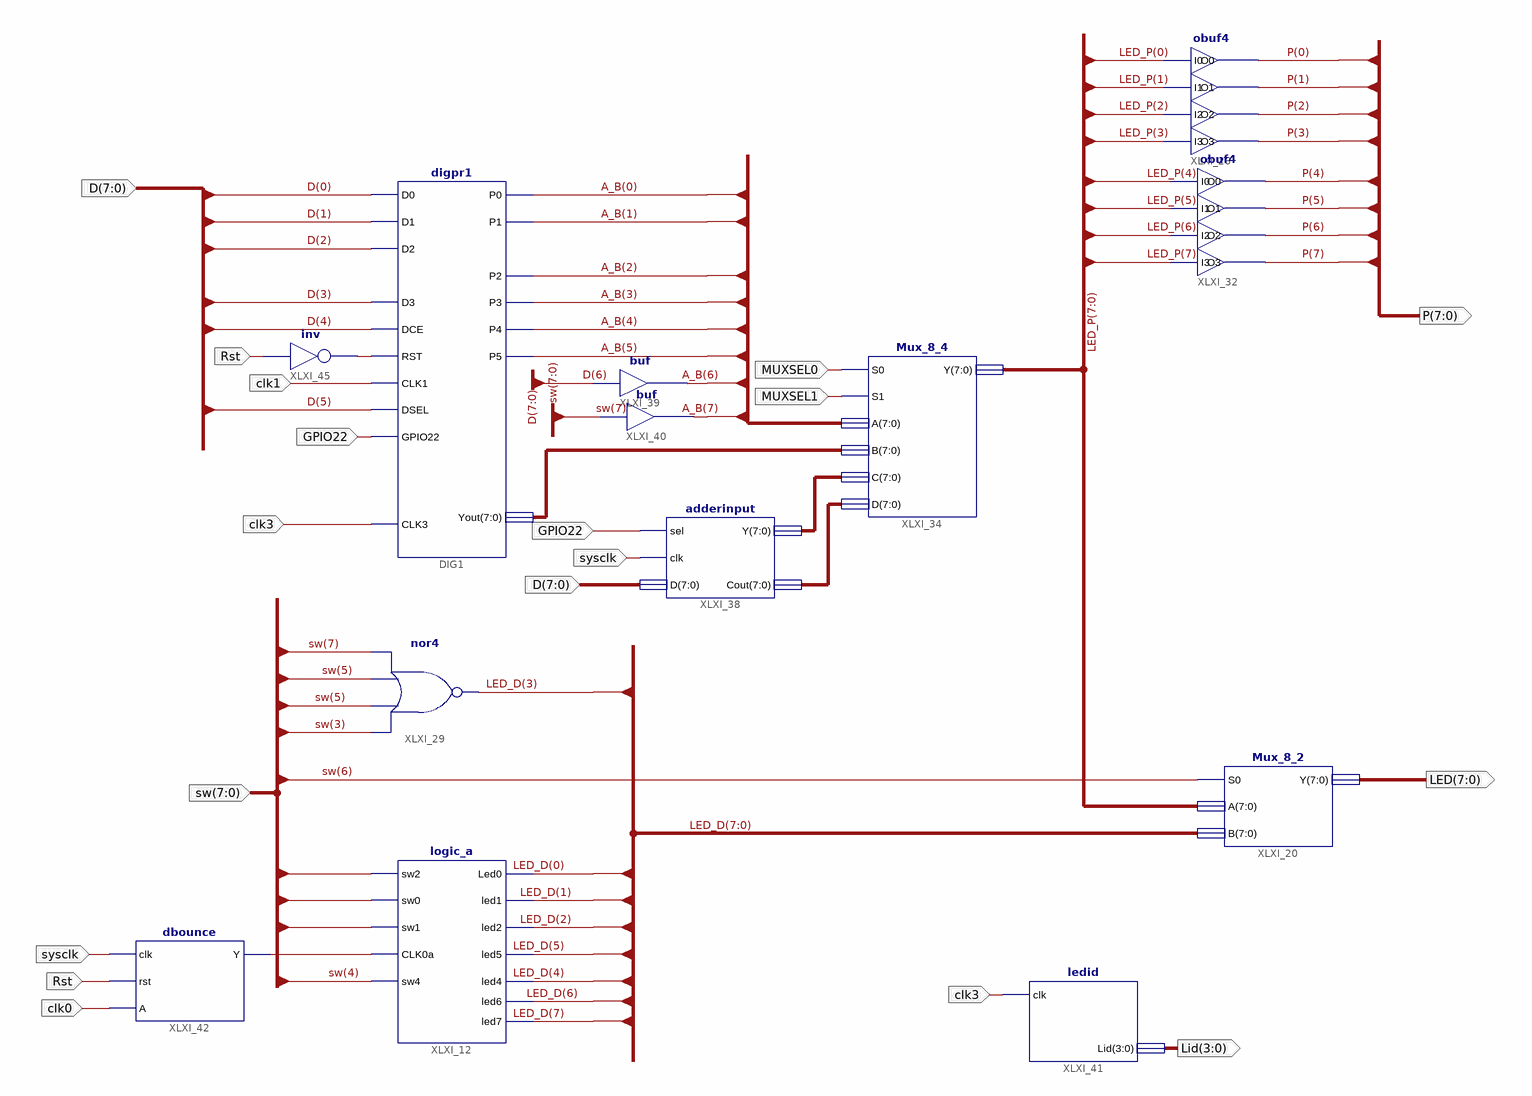
[diagram p0: schematic sheet 1]
// Xilinx ISE schematic digprtop.sch (spartan6) as structural Verilog: 13 symbols, 13 ports
module digprtop (
  input  Rst,
  input  clk1,
  input  [7:0] sw,
  input  clk3,
  input  MUXSEL0,
  input  MUXSEL1,
  input  GPIO22,
  input  [7:0] D,
  input  sysclk,
  input  clk0,
  output [7:0] LED,
  output [7:0] P,
  output [3:0] Lid
);

  wire XLXN_77, XLXN_78;
  wire [7:0] A_B, LED_D, LED_P, XLXN_43, XLXN_63, XLXN_64;

  logic_a XLXI_12 (
    .sw2(sw[2]), .sw0(sw[0]), .sw1(sw[1]), .CLK0a(XLXN_77), .sw4(sw[4]), .Led0(LED_D[0]), .led1(LED_D[1]),
    .led2(LED_D[2]), .led5(LED_D[5]), .led4(LED_D[4]), .led6(LED_D[6]), .led7(LED_D[7]));
  Mux_8_2 XLXI_20 (.S0(sw[6]), .A(LED_P), .B(LED_D), .Y(LED));
  nor XLXI_29 (LED_D[3], sw[3], sw[5], sw[5], sw[7]);
  obuf4 XLXI_26 (
    .I0(LED_P[0]), .I1(LED_P[1]), .I2(LED_P[2]), .I3(LED_P[3]), .O0(P[0]), .O1(P[1]), .O2(P[2]), .O3(P[3]));
  obuf4 XLXI_32 (
    .I0(LED_P[4]), .I1(LED_P[5]), .I2(LED_P[6]), .I3(LED_P[7]), .O0(P[4]), .O1(P[5]), .O2(P[6]), .O3(P[7]));
  digpr1 DIG1 (
    .D0(D[0]), .D1(D[1]), .D2(D[2]), .D3(D[3]), .DCE(D[4]), .RST(XLXN_78), .CLK1(clk1), .GPIO22(GPIO22),
    .DSEL(D[5]), .P0(A_B[0]), .P1(A_B[1]), .P3(A_B[3]), .P4(A_B[4]), .P5(A_B[5]), .Yout(XLXN_43),
    .CLK3(clk3), .P2(A_B[2]));
  Mux_8_4 XLXI_34 (.S0(MUXSEL0), .S1(MUXSEL1), .A(A_B), .B(XLXN_43), .C(XLXN_63), .D(XLXN_64), .Y(LED_P));
  adderinput XLXI_38 (.sel(GPIO22), .clk(sysclk), .D(D), .Y(XLXN_63), .Cout(XLXN_64));
  buf XLXI_39 (A_B[6], D[6]);
  ledid XLXI_41 (.clk(clk3), .Lid(Lid));
  dbounce XLXI_42 (.clk(sysclk), .rst(Rst), .A(clk0), .Y(XLXN_77));
  buf XLXI_40 (A_B[7], sw[7]);
  not XLXI_45 (XLXN_78, Rst);
endmodule
